# EAGLE design Mainland_revA (EAGLE 9.2.0)

## Sheet 1 of 6
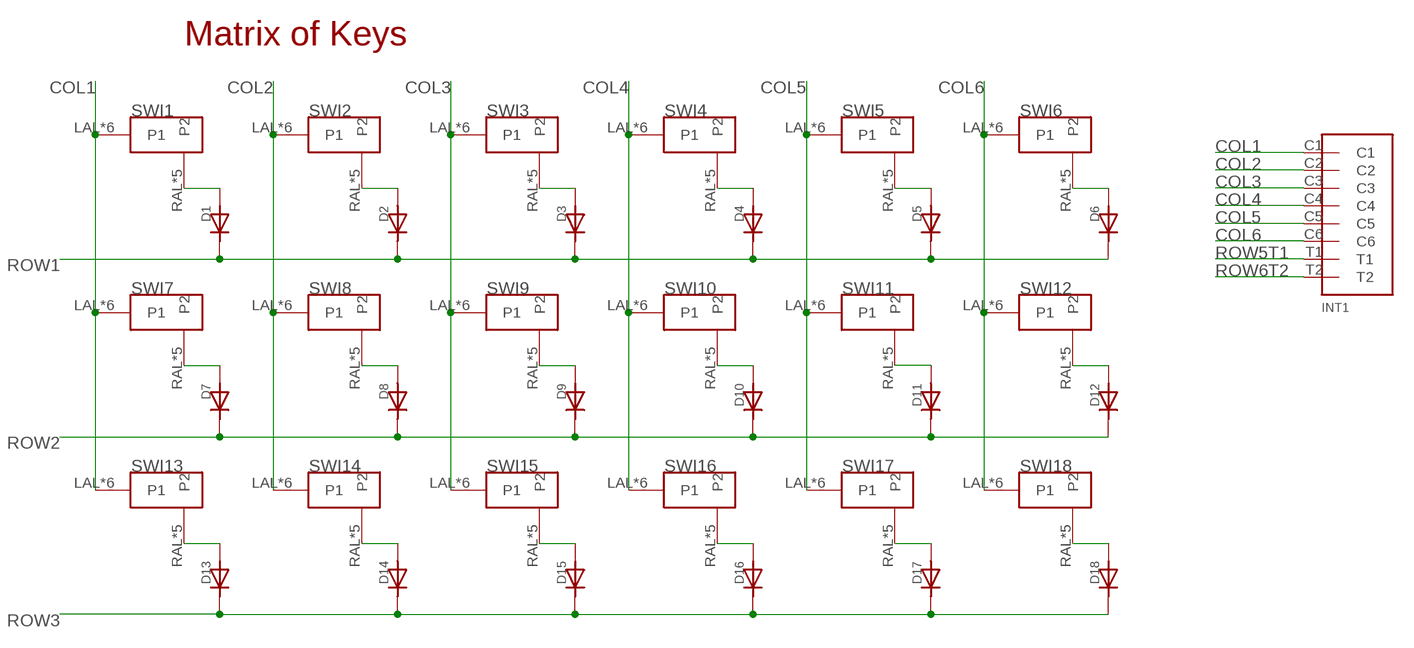
[diagram p0: schematic, sheet 1]

### Parts
D1  DIODE  [DIODE_COMBO]
D2  DIODE  [DIODE_COMBO]
D3  DIODE  [DIODE_COMBO]
D4  DIODE  [DIODE_COMBO]
D5  DIODE  [DIODE_COMBO]
D6  DIODE  [DIODE_COMBO]
D7  DIODE  [DIODE_COMBO]
D8  DIODE  [DIODE_COMBO]
D9  DIODE  [DIODE_COMBO]
D10  DIODE  [DIODE_COMBO]
D11  DIODE  [DIODE_COMBO]
D12  DIODE  [DIODE_COMBO]
D13  DIODE  [DIODE_COMBO]
D14  DIODE  [DIODE_COMBO]
D15  DIODE  [DIODE_COMBO]
D16  DIODE  [DIODE_COMBO]
D17  DIODE  [DIODE_COMBO]
D18  DIODE  [DIODE_COMBO]
INT1  INTRCNNT4X2  [INTRRIBBON]
SWI1  MX/ALPSDOUBLESIDED  [DOUBLED_MX/ALPS]
SWI2  MX/ALPSDOUBLESIDED  [DOUBLED_MX/ALPS]
SWI3  MX/ALPSDOUBLESIDED  [DOUBLED_MX/ALPS]
SWI4  MX/ALPSDOUBLESIDED  [DOUBLED_MX/ALPS]
SWI5  MX/ALPSDOUBLESIDED  [DOUBLED_MX/ALPS]
SWI6  MX/ALPSDOUBLESIDED  [DOUBLED_MX/ALPS]
SWI7  MX/ALPSDOUBLESIDED  [DOUBLED_MX/ALPS]
SWI8  MX/ALPSDOUBLESIDED  [DOUBLED_MX/ALPS]
SWI9  MX/ALPSDOUBLESIDED  [DOUBLED_MX/ALPS]
SWI10  MX/ALPSDOUBLESIDED  [DOUBLED_MX/ALPS]
SWI11  MX/ALPSDOUBLESIDED  [DOUBLED_MX/ALPS]
SWI12  MX/ALPSDOUBLESIDED  [DOUBLED_MX/ALPS]
SWI13  MX/ALPSDOUBLESIDED  [DOUBLED_MX/ALPS]
SWI14  MX/ALPSDOUBLESIDED  [DOUBLED_MX/ALPS]
SWI15  MX/ALPSDOUBLESIDED  [DOUBLED_MX/ALPS]
SWI16  MX/ALPSDOUBLESIDED  [DOUBLED_MX/ALPS]
SWI17  MX/ALPSDOUBLESIDED  [DOUBLED_MX/ALPS]
SWI18  MX/ALPSDOUBLESIDED  [DOUBLED_MX/ALPS]

### Nets
COL1: INT1.C1 SWI1.LAL(P1) SWI1.LAR(P1) SWI1.LCL(P1) SWI1.LCR(P1) SWI1.LLP(P1) SWI1.LRLP(P1) SWI7.LAL(P1) SWI7.LAR(P1) SWI7.LCL(P1) SWI7.LCR(P1) SWI7.LLP(P1) SWI7.LRLP(P1) SWI13.LAL(P1) SWI13.LAR(P1) SWI13.LCL(P1) SWI13.LCR(P1) SWI13.LLP(P1) SWI13.LRLP(P1) ; also sheet 2
COL2: INT1.C2 SWI2.LAL(P1) SWI2.LAR(P1) SWI2.LCL(P1) SWI2.LCR(P1) SWI2.LLP(P1) SWI2.LRLP(P1) SWI8.LAL(P1) SWI8.LAR(P1) SWI8.LCL(P1) SWI8.LCR(P1) SWI8.LLP(P1) SWI8.LRLP(P1) SWI14.LAL(P1) SWI14.LAR(P1) SWI14.LCL(P1) SWI14.LCR(P1) SWI14.LLP(P1) SWI14.LRLP(P1) ; also sheet 2
COL3: INT1.C3 SWI3.LAL(P1) SWI3.LAR(P1) SWI3.LCL(P1) SWI3.LCR(P1) SWI3.LLP(P1) SWI3.LRLP(P1) SWI9.LAL(P1) SWI9.LAR(P1) SWI9.LCL(P1) SWI9.LCR(P1) SWI9.LLP(P1) SWI9.LRLP(P1) SWI15.LAL(P1) SWI15.LAR(P1) SWI15.LCL(P1) SWI15.LCR(P1) SWI15.LLP(P1) SWI15.LRLP(P1) ; also sheet 2
COL4: INT1.C4 SWI4.LAL(P1) SWI4.LAR(P1) SWI4.LCL(P1) SWI4.LCR(P1) SWI4.LLP(P1) SWI4.LRLP(P1) SWI10.LAL(P1) SWI10.LAR(P1) SWI10.LCL(P1) SWI10.LCR(P1) SWI10.LLP(P1) SWI10.LRLP(P1) SWI16.LAL(P1) SWI16.LAR(P1) SWI16.LCL(P1) SWI16.LCR(P1) SWI16.LLP(P1) SWI16.LRLP(P1) ; also sheet 2
COL5: INT1.C5 SWI5.LAL(P1) SWI5.LAR(P1) SWI5.LCL(P1) SWI5.LCR(P1) SWI5.LLP(P1) SWI5.LRLP(P1) SWI11.LAL(P1) SWI11.LAR(P1) SWI11.LCL(P1) SWI11.LCR(P1) SWI11.LLP(P1) SWI11.LRLP(P1) SWI17.LAL(P1) SWI17.LAR(P1) SWI17.LCL(P1) SWI17.LCR(P1) SWI17.LLP(P1) SWI17.LRLP(P1) ; also sheet 2
COL6: INT1.C6 SWI6.LAL(P1) SWI6.LAR(P1) SWI6.LCL(P1) SWI6.LCR(P1) SWI6.LLP(P1) SWI6.LRLP(P1) SWI12.LAL(P1) SWI12.LAR(P1) SWI12.LCL(P1) SWI12.LCR(P1) SWI12.LLP(P1) SWI12.LRLP(P1) SWI18.LAL(P1) SWI18.LAR(P1) SWI18.LCL(P1) SWI18.LCR(P1) SWI18.LLP(P1) SWI18.LRLP(P1) ; also sheet 2
N$1: D1.ANOSB(AN) D1.ANOST(AN) D1.ANOT(AN) SWI1.RAL(P2) SWI1.RAR(P2) SWI1.RCL(P2) SWI1.RCR(P2) SWI1.RLMID(P2)
N$2: D2.ANOSB(AN) D2.ANOST(AN) D2.ANOT(AN) SWI2.RAL(P2) SWI2.RAR(P2) SWI2.RCL(P2) SWI2.RCR(P2) SWI2.RLMID(P2)
N$3: D3.ANOSB(AN) D3.ANOST(AN) D3.ANOT(AN) SWI3.RAL(P2) SWI3.RAR(P2) SWI3.RCL(P2) SWI3.RCR(P2) SWI3.RLMID(P2)
N$4: D4.ANOSB(AN) D4.ANOST(AN) D4.ANOT(AN) SWI4.RAL(P2) SWI4.RAR(P2) SWI4.RCL(P2) SWI4.RCR(P2) SWI4.RLMID(P2)
N$5: D5.ANOSB(AN) D5.ANOST(AN) D5.ANOT(AN) SWI5.RAL(P2) SWI5.RAR(P2) SWI5.RCL(P2) SWI5.RCR(P2) SWI5.RLMID(P2)
N$6: D6.ANOSB(AN) D6.ANOST(AN) D6.ANOT(AN) SWI6.RAL(P2) SWI6.RAR(P2) SWI6.RCL(P2) SWI6.RCR(P2) SWI6.RLMID(P2)
N$7: D7.ANOSB(AN) D7.ANOST(AN) D7.ANOT(AN) SWI7.RAL(P2) SWI7.RAR(P2) SWI7.RCL(P2) SWI7.RCR(P2) SWI7.RLMID(P2)
N$8: D8.ANOSB(AN) D8.ANOST(AN) D8.ANOT(AN) SWI8.RAL(P2) SWI8.RAR(P2) SWI8.RCL(P2) SWI8.RCR(P2) SWI8.RLMID(P2)
N$9: D9.ANOSB(AN) D9.ANOST(AN) D9.ANOT(AN) SWI9.RAL(P2) SWI9.RAR(P2) SWI9.RCL(P2) SWI9.RCR(P2) SWI9.RLMID(P2)
N$10: D10.ANOSB(AN) D10.ANOST(AN) D10.ANOT(AN) SWI10.RAL(P2) SWI10.RAR(P2) SWI10.RCL(P2) SWI10.RCR(P2) SWI10.RLMID(P2)
N$11: D11.ANOSB(AN) D11.ANOST(AN) D11.ANOT(AN) SWI11.RAL(P2) SWI11.RAR(P2) SWI11.RCL(P2) SWI11.RCR(P2) SWI11.RLMID(P2)
N$12: D12.ANOSB(AN) D12.ANOST(AN) D12.ANOT(AN) SWI12.RAL(P2) SWI12.RAR(P2) SWI12.RCL(P2) SWI12.RCR(P2) SWI12.RLMID(P2)
N$13: D13.ANOSB(AN) D13.ANOST(AN) D13.ANOT(AN) SWI13.RAL(P2) SWI13.RAR(P2) SWI13.RCL(P2) SWI13.RCR(P2) SWI13.RLMID(P2)
N$14: D14.ANOSB(AN) D14.ANOST(AN) D14.ANOT(AN) SWI14.RAL(P2) SWI14.RAR(P2) SWI14.RCL(P2) SWI14.RCR(P2) SWI14.RLMID(P2)
N$15: D15.ANOSB(AN) D15.ANOST(AN) D15.ANOT(AN) SWI15.RAL(P2) SWI15.RAR(P2) SWI15.RCL(P2) SWI15.RCR(P2) SWI15.RLMID(P2)
N$16: D16.ANOSB(AN) D16.ANOST(AN) D16.ANOT(AN) SWI16.RAL(P2) SWI16.RAR(P2) SWI16.RCL(P2) SWI16.RCR(P2) SWI16.RLMID(P2)
N$17: D17.ANOSB(AN) D17.ANOST(AN) D17.ANOT(AN) SWI17.RAL(P2) SWI17.RAR(P2) SWI17.RCL(P2) SWI17.RCR(P2) SWI17.RLMID(P2)
N$18: D18.ANOSB(AN) D18.ANOST(AN) D18.ANOT(AN) SWI18.RAL(P2) SWI18.RAR(P2) SWI18.RCL(P2) SWI18.RCR(P2) SWI18.RLMID(P2)
ROW1: D1.CATSB(CAT) D1.CATST(CAT) D1.CATT(CAT) D2.CATSB(CAT) D2.CATST(CAT) D2.CATT(CAT) D3.CATSB(CAT) D3.CATST(CAT) D3.CATT(CAT) D4.CATSB(CAT) D4.CATST(CAT) D4.CATT(CAT) D5.CATSB(CAT) D5.CATST(CAT) D5.CATT(CAT) D6.CATSB(CAT) D6.CATST(CAT) D6.CATT(CAT) ; also sheet 2
ROW2: D7.CATSB(CAT) D7.CATST(CAT) D7.CATT(CAT) D8.CATSB(CAT) D8.CATST(CAT) D8.CATT(CAT) D9.CATSB(CAT) D9.CATST(CAT) D9.CATT(CAT) D10.CATSB(CAT) D10.CATST(CAT) D10.CATT(CAT) D11.CATSB(CAT) D11.CATST(CAT) D11.CATT(CAT) D12.CATSB(CAT) D12.CATST(CAT) D12.CATT(CAT) ; also sheet 2
ROW3: D13.CATSB(CAT) D13.CATST(CAT) D13.CATT(CAT) D14.CATSB(CAT) D14.CATST(CAT) D14.CATT(CAT) D15.CATSB(CAT) D15.CATST(CAT) D15.CATT(CAT) D16.CATSB(CAT) D16.CATST(CAT) D16.CATT(CAT) D17.CATSB(CAT) D17.CATST(CAT) D17.CATT(CAT) D18.CATSB(CAT) D18.CATST(CAT) D18.CATT(CAT) ; also sheet 2
ROW5T1: INT1.T1 ; also sheet 2
ROW6T2: INT1.T2 ; also sheet 2

### Notes on the sheet
- Matrix of Keys

## Sheet 2 of 6
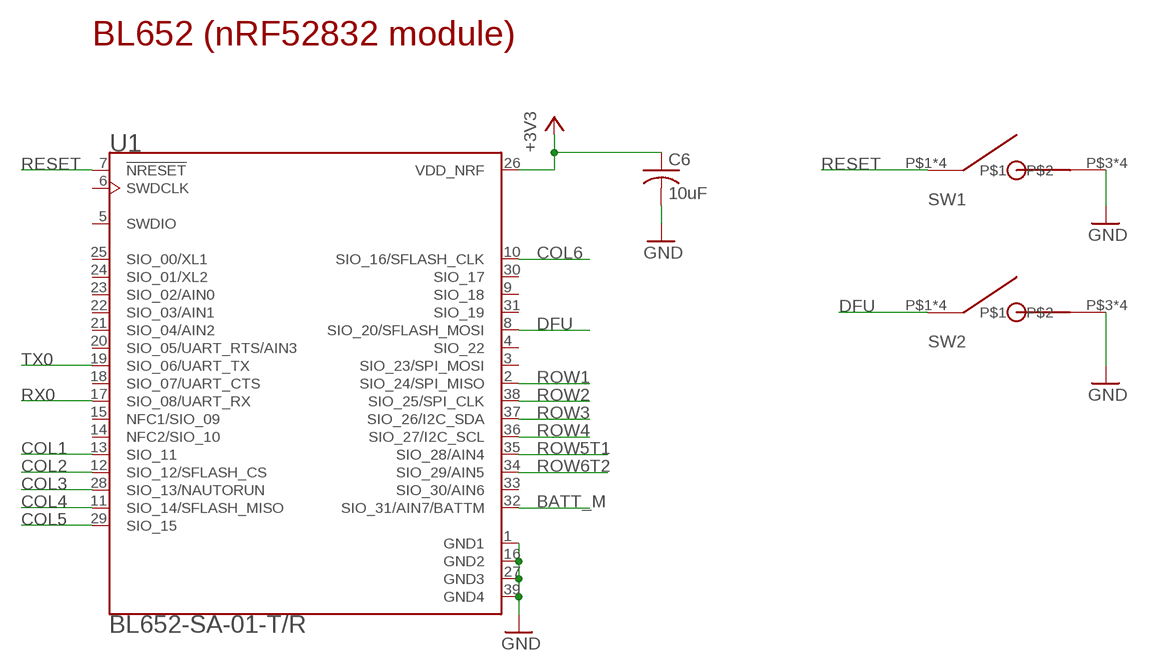
[diagram p1: schematic, sheet 2]

### Parts
C6  10uF  C-USC0805K  [C0805K]
SW1  RSTSWSMD  [FLATSWT]
SW2  RSTSWSMD  [FLATSWT]
U1  BL652-SA-01-T/R  [XCVR_BL652-SA-01-T/R]

### Nets
+3V3: C6.1 U1.26(VDD_NRF) ; also sheet 3,5
BATT_M: U1.32(SIO_31/AIN7/BATTM) ; also sheet 4
COL1: U1.13(SIO_11) ; also sheet 1
COL2: U1.12(SIO_12/SFLASH_CS) ; also sheet 1
COL3: U1.28(SIO_13/NAUTORUN) ; also sheet 1
COL4: U1.11(SIO_14/SFLASH_MISO) ; also sheet 1
COL5: U1.29(SIO_15) ; also sheet 1
COL6: U1.10(SIO_16/SFLASH_CLK) ; also sheet 1
DFU: SW2.P$1 SW2.P$2 SW2.P$5 SW2.P$6 U1.8(SIO_20/SFLASH_MOSI)
GND: C6.2 SW1.P$3 SW1.P$4 SW1.P$7 SW1.P$8 SW2.P$3 SW2.P$4 SW2.P$7 SW2.P$8 U1.1(GND1) U1.16(GND2) U1.27(GND3) U1.39(GND4) ; also sheet 3,4,5,6
RESET: SW1.P$1 SW1.P$2 SW1.P$5 SW1.P$6 U1.7(!NRESET)
ROW1: U1.2(SIO_24/SPI_MISO) ; also sheet 1
ROW2: U1.38(SIO_25/SPI_CLK) ; also sheet 1
ROW3: U1.37(SIO_26/I2C_SDA) ; also sheet 1
ROW4: U1.36(SIO_27/I2C_SCL)
ROW5T1: U1.35(SIO_28/AIN4) ; also sheet 1
ROW6T2: U1.34(SIO_29/AIN5) ; also sheet 1
RX0: U1.17(SIO_08/UART_RX) ; also sheet 5
TX0: U1.19(SIO_06/UART_TX) ; also sheet 5
Unconnected: U1.3(SIO_23/SPI_MOSI) U1.4(SIO_22) U1.5(SWDIO) U1.6(SWDCLK) U1.9(SIO_18) U1.14(NFC2/SIO_10) U1.15(NFC1/SIO_09) U1.18(SIO_07/UART_CTS) U1.20(SIO_05/UART_RTS/AIN3) U1.21(SIO_04/AIN2) U1.22(SIO_03/AIN1) U1.23(SIO_02/AIN0) U1.24(SIO_01/XL2) U1.25(SIO_00/XL1) U1.30(SIO_17) U1.31(SIO_19) U1.33(SIO_30/AIN6)

### Notes on the sheet
- BL652 (nRF52832 module)

## Sheet 3 of 6
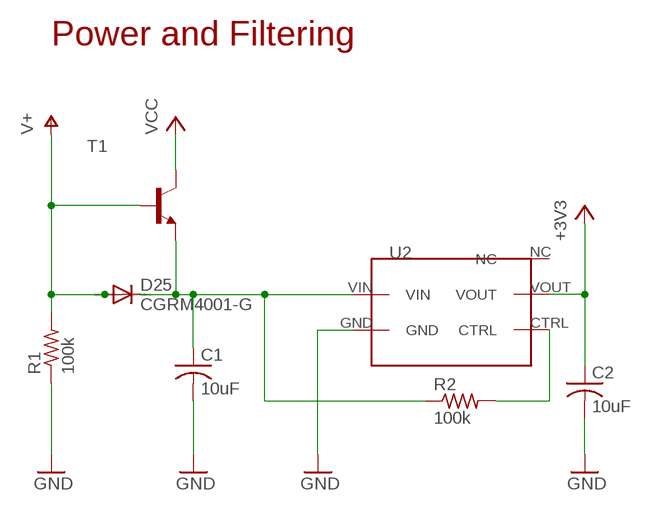
[diagram p2: schematic, sheet 3]

### Parts
C1  10uF  C-USC0805K  [C0805K]
C2  10uF  C-USC0805K  [C0805K]
D25  CGRM4001-G  [SOD-123_MINI-SMA]
R1  100k  R-US_R0402  [R0402]
R2  100k  R-US_R0402  [R0402]
T1  BC808-NPN-SOT23-BEC  [SOT23-BEC]
U2  TCR2EF  [TCR2EF]

### Nets
+3V3: C2.1 U2.VOUT ; also sheet 2,5
GND: C1.2 C2.2 R1.1 U2.GND ; also sheet 2,4,5,6
N$25: R2.2 U2.CTRL
N$26: C1.1 D25.C R2.1 T1.E U2.VIN
V+: D25.A R1.2 T1.B ; also sheet 4,5,6
VCC: T1.C ; also sheet 4,6
Unconnected: U2.NC

### Notes on the sheet
- Power and Filtering

## Sheet 4 of 6
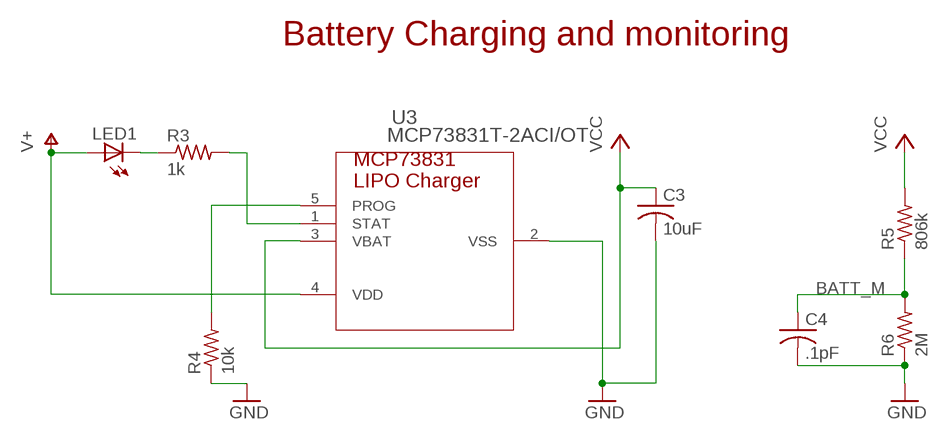
[diagram p3: schematic, sheet 4]

### Parts
C3  10uF  C-USC0805K  [C0805K]
C4  .1pF  C-USC0402K  [C0402K]
LED1  LEDCHIP-LED0603  [CHIP-LED0603]
R3  1k  R-US_R0402  [R0402]
R4  10k  R-US_R0402  [R0402]
R5  806k  R-US_R0402  [R0402]
R6  2M  R-US_R0402  [R0402]
U3  MCP73831T-2ACI/OT  [SOT-23-5_MC]

### Nets
BATT_M: C4.1 R5.1 R6.2 ; also sheet 2
GND: C3.2 C4.2 R4.1 R6.1 U3.2(VSS) ; also sheet 2,3,5,6
N$27: LED1.C R3.1
N$28: R3.2 U3.1(STAT)
N$29: R4.2 U3.5(PROG)
V+: LED1.A U3.4(VDD) ; also sheet 3,5,6
VCC: C3.1 R5.2 U3.3(VBAT) ; also sheet 3,6

### Notes on the sheet
- Battery Charging and monitoring

## Sheet 5 of 6
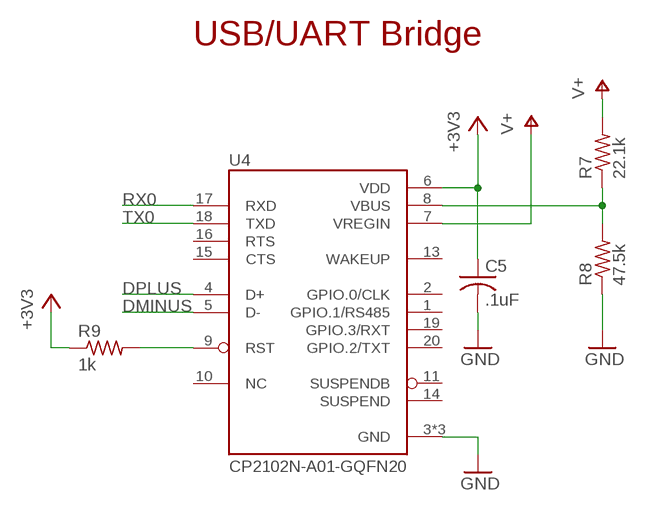
[diagram p4: schematic, sheet 5]

### Parts
C5  .1uF  C-USC0402K  [C0402K]
R7  22.1k  R-US_R0402  [R0402]
R8  47.5k  R-US_R0402  [R0402]
R9  1k  R-US_R0402  [R0402]
U4  CP2102N-A01-GQFN20  [SILABS_QFN20]

### Nets
+3V3: C5.1 R9.1 U4.6(VDD) ; also sheet 2,3
DMINUS: U4.5(D-) ; also sheet 6
DPLUS: U4.4(D+) ; also sheet 6
GND: C5.2 R8.1 U4.3(GND) U4.12(GND) U4.21(GND) ; also sheet 2,3,4,6
N$31: R7.1 R8.2 U4.8(VBUS)
N$32: R9.2 U4.9(RST)
RX0: U4.17(RXD) ; also sheet 2
TX0: U4.18(TXD) ; also sheet 2
V+: R7.2 U4.7(VREGIN) ; also sheet 3,4,6
Unconnected: U4.1(GPIO.1/RS485) U4.2(GPIO.0/CLK) U4.10(NC) U4.11(SUSPENDB) U4.13(WAKEUP) U4.14(SUSPEND) U4.15(CTS) U4.16(RTS) U4.19(GPIO.3/RXT) U4.20(GPIO.2/TXT)

### Notes on the sheet
- USB/UART Bridge

## Sheet 6 of 6
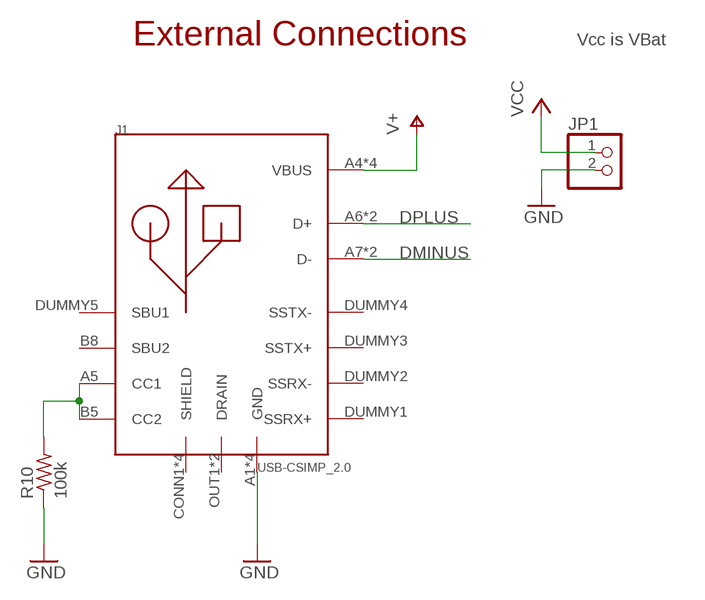
[diagram p5: schematic, sheet 6]

### Parts
J1  USB-CSIMP_2.0  [CX70M-P1_SIMP]
JP1  PINHD-1X2  [1X02]
R10  100k  R-US_R0402  [R0402]

### Nets
DMINUS: J1.A7(D-) J1.B7(D-) ; also sheet 5
DPLUS: J1.A6(D+) J1.B6(D+) ; also sheet 5
GND: J1.A1(GND) J1.A12(GND) J1.B1(GND) J1.B12(GND) JP1.2 R10.1 ; also sheet 2,3,4,5
N$19: J1.A5(CC1) J1.B5(CC2) R10.2
V+: J1.A4(VBUS) J1.A9(VBUS) J1.B4(VBUS) J1.B9(VBUS) ; also sheet 3,4,5
VCC: JP1.1 ; also sheet 3,4
Unconnected: J1.B8(SBU2) J1.CONN1(SHIELD) J1.CONN2(SHIELD) J1.CONN3(SHIELD) J1.CONN4(SHIELD) J1.DUMMY1(SSRX+) J1.DUMMY2(SSRX-) J1.DUMMY3(SSTX+) J1.DUMMY4(SSTX-) J1.DUMMY5(SBU1) J1.OUT1(DRAIN) J1.OUT2(DRAIN)

### Notes on the sheet
- External Connections | Vcc is VBat

## Library data of the parts
C1-C6 = resistor:C-US: CAPACITOR, American symbol
D1-D18 = Keys:DIODE
D25 = diode:CGRM400*-G: Molded plasitc,JEDEC SOD-123/Mini SMA Source: Comchip CGRM4001-G.pdf
INT1 = Keys:INTRCNNT
J1 = Keys:USB-C
JP1 = pinhead:PINHD-1X2: PIN HEADER
LED1 = led:LED: LED OSRAM: - CHIPLED LG R971, LG N971, LY N971, LG Q971, LY Q971, LO R971, LY R971 LH N974, LH R974 LS Q976, LO Q976, LY Q976 LO Q996 - Hyper CHIPLED LW Q18S LB Q993, LB Q99A, LB R99A - SideLED LS A670, LO A670, LY A670, LG A670, LP A670 LB A673, LV A673, LT A673, LW A673 LH A674 LY A675 LS A676, LA A676, LO A676, LY A676, LW A676 LS A679, LY A679, LG A679 - Hyper Micro SIDELED® LS Y876, LA Y876, LO Y876, LY Y876 LT Y87S - SmartLED LW L88C, LW L88S LB L89C, LB L89S, LG L890 LS L89K, LO L89K, LY L89K LS L896, LA L896, LO L896, LY L896 - TOPLED LS T670, LO T670, LY T670, LG T670, LP T670 LSG T670, LSP T670, LSY T670, LOP T670, LYG T670 LG T671, LOG T671, LSG T671 LB T673, LV T673, LT T673, LW T673 LH T674 LS T676, LA T676, LO T676, LY T676, LB T676, LH T676, LSB T676, LW T676 LB T67C, LV T67C, LT T67C, LS T67K, LO T67K, LY T67K, LW E67C LS E67B, LA E67B, LO E67B, LY E67B, LB E67C, LV E67C, LT E67C LW T67C LS T679, LY T679, LG T679 LS T770, LO T770, LY T770, LG T770, LP T770 LB T773, LV T773, LT T773, LW T773 LH T774 LS E675, LA E675, LY E675, LS T675 LS T776, LA T776, LO T776, LY T776, LB T776 LHGB T686 LT T68C, LB T68C - Hyper Mini TOPLED® LB M676 - Mini TOPLED Santana® LG M470 LS M47K, LO M47K, LY M47K Source: http://www.osram.convergy.de LUXEON: - LUMILED® LXK2-PW12-R00, LXK2-PW12-S00, LXK2-PW14-U00, LXK2-PW14-V00 LXK2-PM12-R00, LXK2-PM12-S00, LXK2-PM14-U00 LXK2-PE12-Q00, LXK2-PE12-R00, LXK2-PE12-S00, LXK2-PE14-T00, LXK2-PE14-U00 LXK2-PB12-K00, LXK2-PB12-L00, LXK2-PB12-M00, LXK2-PB14-N00, LXK2-PB14-P00, LXK2-PB14-Q00 LXK2-PR12-L00, LXK2-PR12-M00, LXK2-PR14-Q00, LXK2-PR14-R00 LXK2-PD12-Q00, LXK2-PD12-R00, LXK2-PD12-S00 LXK2-PH12-R00, LXK2-PH12-S00 LXK2-PL12-P00, LXK2-PL12-Q00, LXK2-PL12-R00 Source: www.luxeon.com KINGBRIGHT: KA-3528ASYC Source: www.kingbright.com
R1-R10 = resistor:R-US_: RESISTOR, American symbol
SW1 SW2 = Keys:RSTSW
SWI1-SWI18 = Keys:MX/ALPS
T1 = transistor:*-NPN-: NPN Transistror BF959 corrected 2008.03.06
U1 = BL652-SA-01-T_R:BL652-SA-01-T/R: Bluetooth v4.2 Module with NFC (Integrated Antenna); DESCRIPTION: Bluetooth 1.8V to 3.6V 1Mbps 39-Pin SMD Module T/R; DIGI-KEY_PART_NUMBER: BL652-SA-01-CT-ND; DIGI-KEY_PURCHASE_URL: https://www.digikey.com/product-detail/en/laird-wireless-thermal-systems/BL652-SA-01-T-R/BL652-SA-01-CT-ND/6181738?utm_source=snapeda&utm_medium=aggregator&utm_campaign=symbol; MF: Laird -; MP: BL652-SA-01-T/R; PACKAGE: SMD-39 Laird
U2 = Keys:TCR2EF
U3 = MCP73831:MCP73831T-2ACI/OT; MANUFACTURER_PART_NUMBER: MCP73831T2ACIOT; VENDOR: Microchip
U4 = CP2102N-A01-GQFN20:CP2102N-A01-GQFN20: Ic Bridge Usb To Uart 20qfn; DESCRIPTION: Usb-Uart Interface Bridge, Qfn-20; DIGI-KEY_PART_NUMBER: 336-3692-ND; DIGI-KEY_PURCHASE_URL: https://www.digikey.com/product-detail/en/silicon-labs/CP2102N-A01-GQFN20/336-3692-ND/6012517?utm_source=snapeda&utm_medium=aggregator&utm_campaign=symbol; MF: Silicon Labs; MP: CP2102N-A01-GQFN20; PACKAGE: QFN-20 Silicon Labs

## Net classes
1 Power: width 0.254 mm

## Board
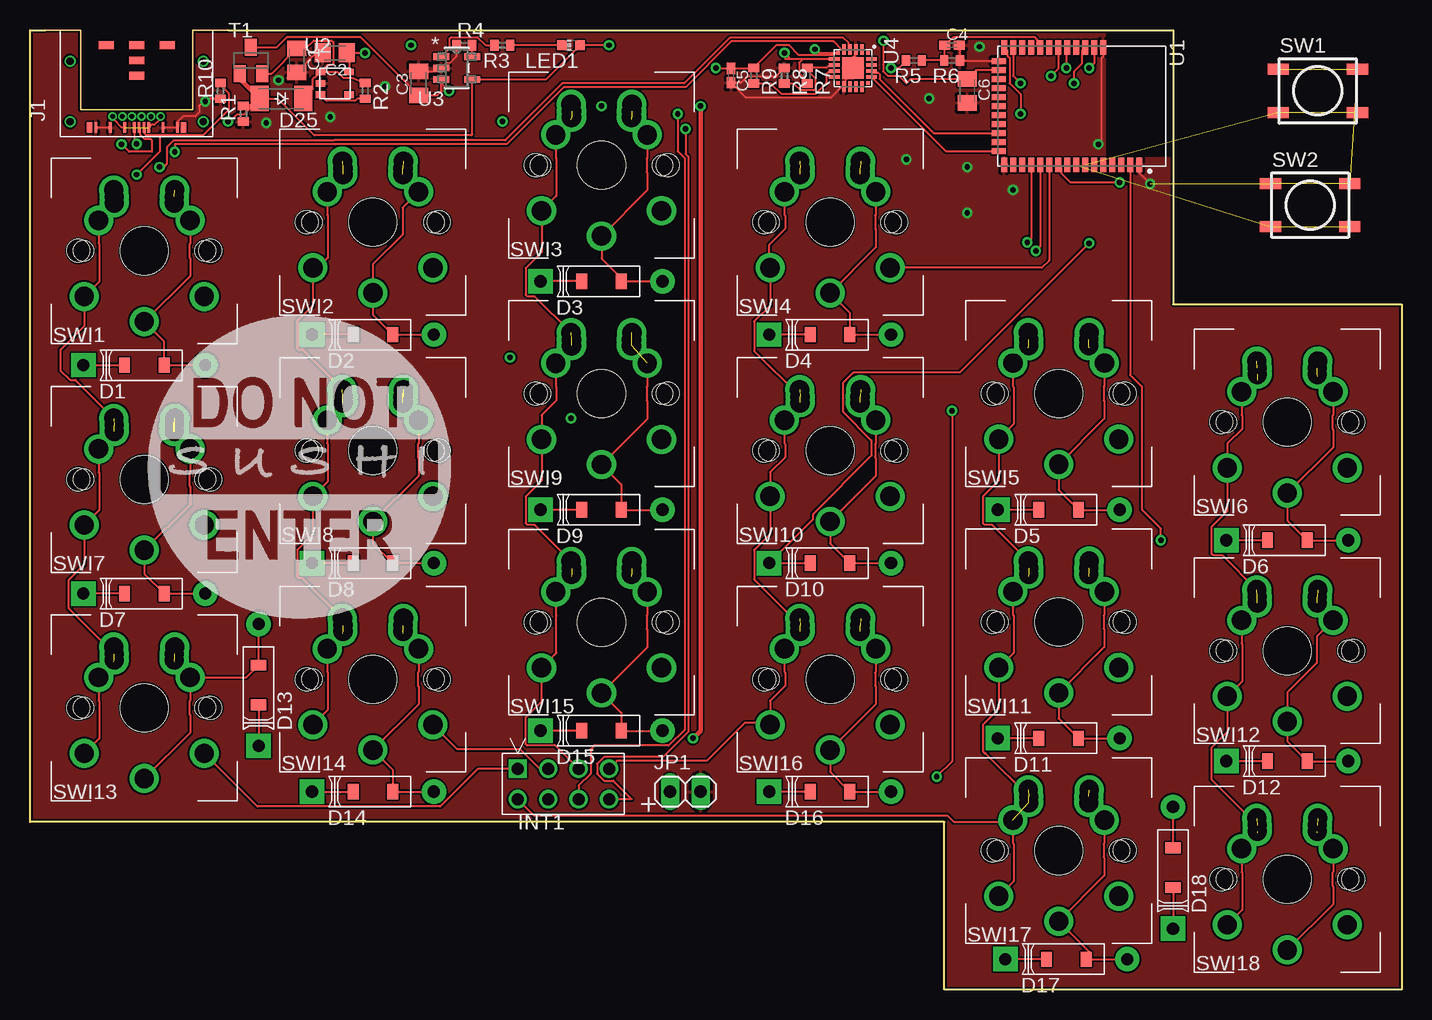
[diagram p6: board, top side]
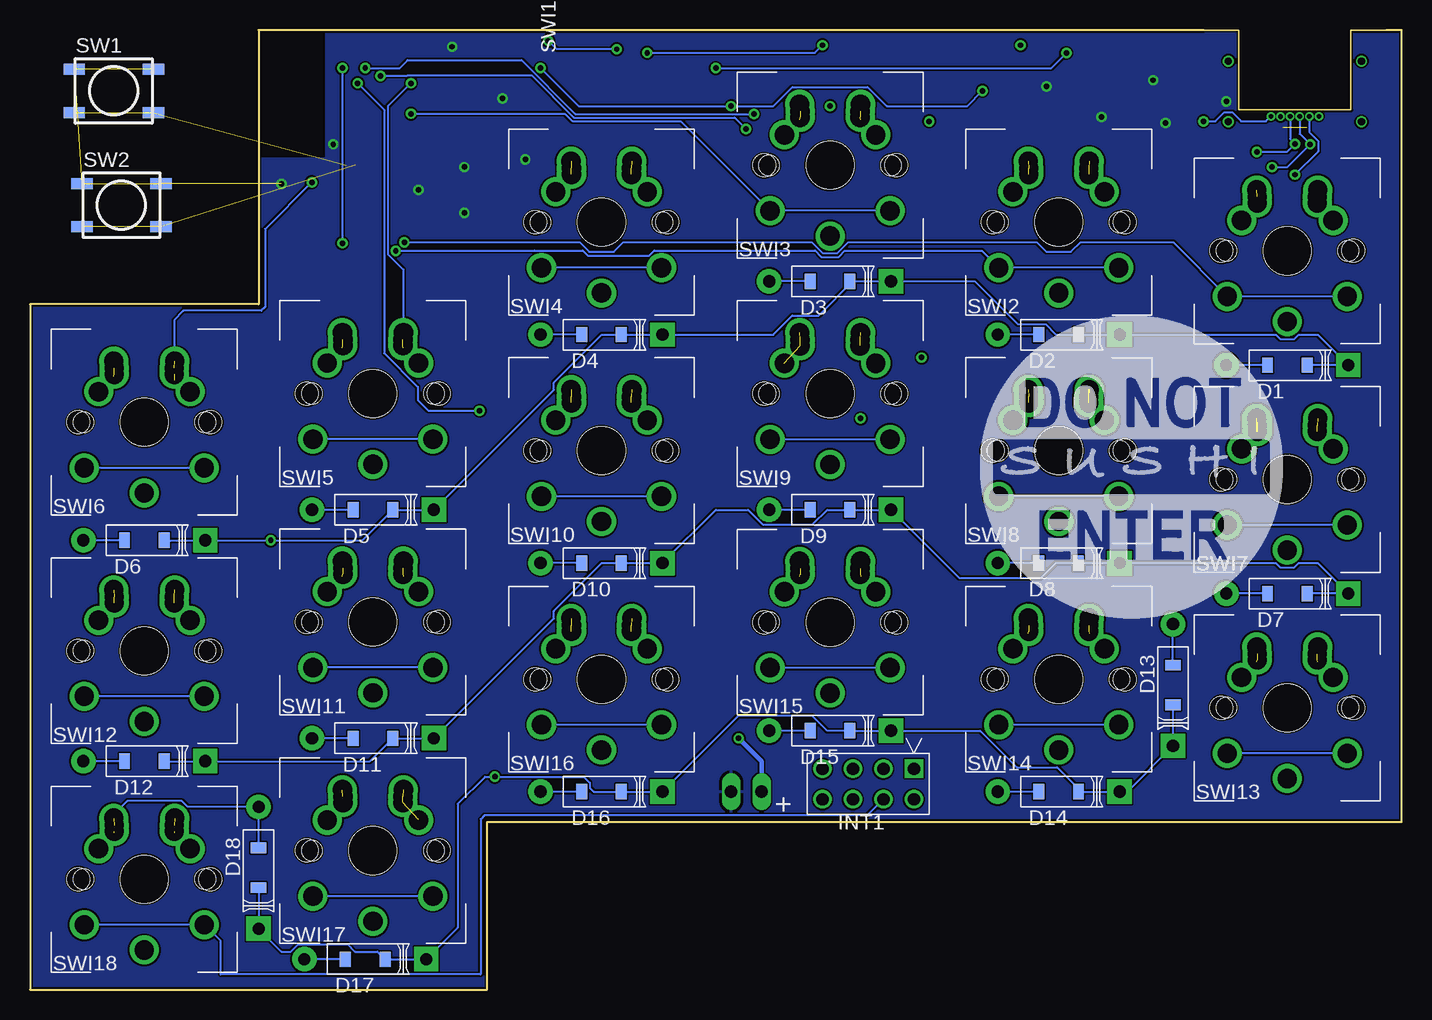
[diagram p7: board, bottom side, seen from below]

Size 114.3 x 80.01 mm. Coordinates in mm from the lower left corner, seen from the top.
Outline: 1.27,80.01 0,80.01 0,13.97 76.2,13.97 76.2,0 114.3,0 114.3,57.15 95.25,57.15 95.25,80.01 16.51,80.01
Copper layers (1*16): Top 0.035mm / dielectric 1.5mm / Bottom 0.035mm
Design rules "Sierra *": minimum track width 6mil, minimum drill 10mil, track to track 6mil, track to pad 6mil, pad to pad 6mil, via to via 6mil, smd to smd 6mil, copper to edge 6mil, drill to drill 10mil, minimum pad ring 6mil, minimum via ring 8mil, stop-mask expansion 4mil, vias tented up to drill 0mil, thermal gap 10mil
tKeepout: area 90.2,69.8 to 95.9,80.6
bKeepout: area 90.2,69.8 to 95.9,80.6
tRestrict: area 89.8,69.5 to 95.9,80.6
bRestrict: area 89.8,69.5 to 95.9,80.6

### Footprints (pad centres in the part's own frame; a part is rotated, then mirrored left to right if it is on the bottom)
C0805K = smd 1.3 x 1.6: 1 -1,0; 2 1,0
C0402K = smd 0.925 x 0.74: 1 -0.6,0; 2 0.6,0
DIODE_COMBO = smd 0.914 x 1.27 bottom: ANOSB 1.651,0; CATSB -1.651,0 | smd 0.914 x 1.27: ANOST 1.651,0; CATST -1.651,0 | drill 1.016 pad 2.032: ANOT 5.08,0 | drill 1.016 pad 2.032 square: CATT -5.08,0
SOD-123_MINI-SMA = smd 1.5 x 2.1: A 1.8,0; C -1.8,0
INTRRIBBON = drill 1.016 square: C1 0,0 | drill 1.016: C2 2.54,0; C3 5.08,0; C4 7.62,0; C5 0,-2.54; C6 2.54,-2.54; T1 5.08,-2.54; T2 7.62,-2.54
CX70M-P1_SIMP = smd 0.23 x 0.85: A1 2.2,-8.125; A4 1,-8.125; A5 0.6,-8.125; A6 0.2,-8.125; A7 -0.2,-8.125; A9 -1,-8.125; A12 -2.2,-8.125; B1 -3.4,-8.125; B12 3.4,-8.125 | drill 0.4 pad 0.6: B4 -2,-7.2; B5 -1.2,-7.2; B6 -0.4,-7.2; B7 0.4,-7.2; B8 1.2,-7.22; B9 2,-7.2 | drill 0.6: CONN1 -5.55,-2.6; CONN2 5.55,-2.6; CONN3 -5.55,-7.65; CONN4 5.55,-7.65 | smd 1.27 x 0.635: DUMMY1 -2.54,-1.27; DUMMY2 0,-1.27; DUMMY3 2.54,-1.27; DUMMY4 0,-2.54; DUMMY5 0,-3.81 | smd 0.46 x 0.85: OUT1 -3.915,-8.125; OUT2 3.915,-8.125
1X02 = drill 1.016 long: 1 -1.27,0; 2 1.27,0
CHIP-LED0603 = smd 0.8 x 0.8: A 0,-0.75; C 0,0.75
R0402 = smd 0.7 x 0.9: 1 -0.65,0; 2 0.65,0
FLATSWT = smd 1.778 x 0.914: P$1 -3.3,-1.8; P$2 3.3,-1.8; P$3 -3.3,1.8; P$4 3.3,1.8 | smd 1.778 x 0.914 bottom: P$5 -3.3,-1.8; P$6 3.3,-1.8; P$7 -3.3,1.8; P$8 3.3,1.8
DOUBLED_MX/ALPS = drill 1.613: LAL -2.5,4; LAR -2.5,4.5; LCL -3.81,2.54; LCR -2.54,5.08; LLP -5,-3.8; LRLP 5,-3.8; RAL 2.5,4; RAR 2.5,4.5; RCL 3.81,2.54; RCR 2.54,5.08; RLMID 0,-5.9 | hole 3.988: 0,0 | hole 1.702: -5.08,0; 5.08,0 | hole 1.9: -5.5,0; 5.5,0
SOT23-BEC = smd 1 x 1.4: B -0.95,-1.1; C 0,1.1; E 0.95,-1.1
XCVR_BL652-SA-01-T/R = smd 1.2 x 0.5: 1 4.9,4.8; 2 4.9,4.05; 3 4.9,3.3; 4 4.9,2.55; 5 4.9,1.8; 6 4.9,1.05; 7 4.9,0.3; 8 4.9,-0.45; 9 4.9,-1.2; 10 4.9,-1.95; 11 4.9,-2.7; 12 4.9,-3.45; 13 4.9,-4.2; 14 4.9,-4.95; 15 4.9,-5.7; 16 4.9,-6.45; 28 -4.9,-6.45; 29 -4.9,-5.7; 30 -4.9,-4.95; 31 -4.9,-4.2; 32 -4.9,-3.45; 33 -4.9,-2.7; 34 -4.9,-1.95; 35 -4.9,-1.2; 36 -4.9,-0.45; 37 -4.9,0.3; 38 -4.9,1.05; 39 -4.9,1.8 | smd 0.5 x 1.2: 17 3.75,-6.9; 18 3,-6.9; 19 2.25,-6.9; 20 1.5,-6.9; 21 0.75,-6.9; 22 0,-6.9; 23 -0.75,-6.9; 24 -1.5,-6.9; 25 -2.25,-6.9; 26 -3,-6.9; 27 -3.75,-6.9
TCR2EF = smd 0.8 x 0.55: CTRL -1.2,-0.95; GND -1.2,0; NC 1.2,-0.95; VIN -1.2,0.95; VOUT 1.2,0.95
SOT-23-5_MC = smd 1.321 x 0.559: 1 -1.295,0.95; 2 -1.295,0; 3 -1.295,-0.95; 4 1.295,-0.95; 5 1.295,0.95
SILABS_QFN20 = smd 0.3 x 0.3: 1 -1.25,1.25; 6 -1.25,-1.25; 11 1.25,-1.25; 16 1.25,1.25 | smd 0.9 x 0.3: 2 -1.55,0.75; 3 -1.55,0.25; 4 -1.55,-0.25; 5 -1.55,-0.75; 12 1.55,-0.75; 13 1.55,-0.25; 14 1.55,0.25; 15 1.55,0.75 | smd 0.3 x 0.9: 7 -0.75,-1.55; 8 -0.25,-1.55; 9 0.25,-1.55; 10 0.75,-1.55; 17 0.75,1.55; 18 0.25,1.55; 19 -0.25,1.55; 20 -0.75,1.55 | smd 1.8 x 1.8: 21 0,0

### Placement (x,y rotation side)
C1  22.23,77.47 270 top
C2  25.4,78.1 180 top
C3  32.38,75.56 90 top
C4  76.84,78.74 0 top
C5  58.42,76.2 270 top
C6  78.1,74.93 270 top
D1  9.52,52.07 0 top
D2  28.57,54.61 0 top
D3  47.63,59.05 0 top
D4  66.68,54.61 0 top
D5  85.72,40.01 0 top
D6  104.78,37.46 0 top
D7  9.52,33.02 0 top
D8  28.57,35.56 0 top
D9  47.63,40.01 0 top
D10  66.68,35.56 0 top
D11  85.72,20.95 0 top
D12  104.78,19.05 0 top
D13  19.05,25.4 90 top
D14  28.57,16.51 0 top
D15  47.63,21.59 0 top
D16  66.68,16.51 0 top
D17  86.36,2.54 0 top
D18  95.25,10.16 90 top
D25  20.95,74.29 180 top
INT1  40.64,18.41 0 top
J1  8.89,80.01 0 top
JP1  54.61,16.51 0 top
LED1  45.09,78.74 90 top
R1  17.78,73.03 90 top
R2  27.94,74.93 270 top
R3  39.37,78.74 180 top
R4  36.2,78.74 0 top
R5  73.66,77.47 180 top
R6  76.84,77.47 180 top
R7  64.77,76.2 270 top
R8  62.87,76.2 270 top
R9  60.32,76.2 270 top
R10  15.88,74.93 90 top
SW1  107.31,74.93 0 top
SW2  106.68,65.41 0 top
SWI1  9.52,61.59 0 top
SWI2  28.57,63.98 0 top
SWI3  47.63,68.73 0 top
SWI4  66.68,63.98 0 top
SWI5  85.72,49.7 0 top
SWI6  104.78,47.31 0 top
SWI7  9.52,42.54 0 top
SWI8  28.57,44.93 0 top
SWI9  47.63,49.68 0 top
SWI10  66.68,44.93 0 top
SWI11  85.72,30.65 0 top
SWI12  104.78,28.26 0 top
SWI13  9.52,23.49 0 top
SWI14  28.57,25.88 0 top
SWI15  47.63,30.63 0 top
SWI16  66.68,25.88 0 top
SWI17  85.72,11.6 0 top
SWI18  104.78,9.21 0 top
T1  18.41,77.47 0 top
U1  87.63,73.66 270 top
U2  25.4,75.56 0 top
U3  35.56,76.84 0 top
U4  68.58,76.84 270 top
U$1  [1INCH_TOP]  9.78,30.86 0 top
U$2  [1INCH_BOT]  9.78,30.86 0 top

### Tracks (layer width: path | path; a pad name or v marks a point on that pad's centre or on a via)
+3V3  (via drill 0.45)
  Top 0.152: U1.26 78.84,76.66 C6.1 73.39,75.93 73.03,75.56 72.41,76.18 71.48,76.18 71.1,76.56 71.1,77.11 71.12,77.13 v71.12,79.11 | 26.54,77.97 26.6,77.91 U2.VOUT | 26.54,77.97 C2.1 | v57.15,76.84 57.18,76.8 C5.1 60.27,76.8 R9.1 62.24,78.76 63.21,78.76 64.01,77.96 66.92,77.96 67.04,78.09 U4.6 65.73,78.09 v65.41,78.41 | v27.93,78.09 26.66,78.09 26.54,77.97
  Bottom 0.152: v57.15,76.84 29.19,76.84 v27.93,78.09 | v65.41,78.41 70.42,78.41 v71.12,79.11
BATT_M
  Top 0.152: R5.1 R6.2 76.19,78.69 C4.1 76.28,78.74 76.93,79.39 83.78,79.39 83.91,79.25 83.91,78.83 U1.32
COL1  (via drill 0.45)  (4 unrouted)
  Top 0.152: SWI1.LAR 7.02,66.63 SWI1.LCR 6.98,64.77 | SWI1.LAR SWI1.LAL | SWI1.LAR 7.02,65.44 SWI1.LCL 5.72,62.2 5.77,62.15 5.77,59.04 SWI1.LLP 4.52,55.32 2.54,53.34 2.54,51.62 3.33,50.82 3.79,50.82 SWI7.LCR | SWI7.LAL 7.02,46.4 SWI7.LCL 5.72,43.15 5.77,43.09 5.77,39.99 SWI7.LLP 4.52,35.45 3.2,34.13 3.2,31.82 SWI13.LAR | SWI13.LCR 6.98,27.3 SWI13.LCL 5.72,24.1 5.77,24.04 5.77,20.94 SWI13.LLP | INT1.C1 37.32,18.41 34.17,15.27 18.95,15.27 SWI13.LRLP | U1.13 83.43,62.63 v83.11,62.31
  Bottom 0.152: SWI1.LLP SWI1.LRLP 19.04,62.31 26.76,62.31 27.55,61.51 29.6,61.51 30.39,62.31 46.12,62.31 47.03,61.39 48.22,61.39 49.13,62.31 64.86,62.31 65.65,61.51 67.7,61.51 68.49,62.31 v83.11,62.31 | SWI7.LLP SWI7.LRLP | SWI13.LLP SWI13.LRLP
COL2  (via drill 0.45)  (6 unrouted)
  Top 0.152: SWI2.LAR 25.54,67.94 25.4,67.94 25.4,67.16 SWI2.LCL 24.77,64.59 24.82,64.53 24.82,61.02 23.57,59.77 | 23.49,59.69 23.57,59.77 | 23.57,59.77 SWI2.LLP 23.57,57.04 22.25,55.72 22.25,53.5 22.38,53.37 22.68,53.37 SWI8.LCR | SWI8.LAR 24.77,48.12 SWI8.LCL 24.77,45.54 24.82,45.48 24.82,42.38 SWI8.LLP 23.57,37.99 22.25,36.67 22.25,34.45 22.38,34.31 22.68,34.31 SWI14.LCR 26.04,29.69 SWI14.LCL 24.77,26.49 24.82,26.43 24.82,23.33 SWI14.LLP | INT1.C2 42.49,18.41 40.86,20.04 35.62,20.04 SWI14.LRLP | U1.12 84.18,61.95 v83.82,61.59
  Bottom 0.152: SWI2.LLP SWI2.LRLP 34.99,61.59 46.4,61.59 46.9,61.09 48.35,61.09 48.88,61.62 62.27,61.62 62.68,61.21 67.82,61.21 68.24,61.62 72.27,61.62 72.3,61.59 v83.82,61.59 | SWI8.LLP SWI8.LRLP | SWI14.LLP SWI14.LRLP
COL3  (via drill 0.45)  (6 unrouted)
  Top 0.152: SWI3.LCR 45.09,72.54 SWI3.LCL 43.82,69.34 43.87,69.28 43.87,66.18 SWI3.LLP 42.63,61.49 41.3,60.17 41.3,57.94 41.43,57.81 42.04,57.81 SWI9.LCR | SWI9.LAL 43.82,52.37 SWI9.LCL 43.82,50.29 43.87,50.23 43.87,49.13 42.63,47.89 SWI9.LLP 42.63,42.44 41.3,41.12 41.3,38.89 41.43,38.76 42.04,38.76 SWI15.LCR 45.09,34.44 SWI15.LCL 43.82,31.24 43.87,31.18 43.87,28.08 SWI15.LLP 42.63,24.02 41.3,22.7 41.3,20.48 41.43,20.34 43.79,20.34 INT1.C3 | U1.28 81.45,78.29 81.45,77.87 81.62,77.69 81.62,75.56 82.55,74.64 v82.55,73.03
  Bottom 0.152: SWI3.LLP SWI3.LRLP 60.09,72.39 69.1,72.39 69.74,73.03 v82.55,73.03 | SWI9.LLP SWI9.LRLP | SWI15.LLP SWI15.LRLP
COL4  (6 unrouted)
  Top 0.152: SWI4.LAL 62.87,66.67 SWI4.LCL 62.87,64.59 62.92,64.53 62.92,63.43 61.6,62.11 61.6,60.18 | SWI10.LAR 60.35,53.26 60.35,55.72 61.68,57.04 SWI4.LLP 61.6,60.18 | SWI10.LAL 62.87,47.62 SWI10.LCL 62.87,45.54 62.92,45.48 62.92,44.38 61.68,43.14 SWI10.LLP 61.68,37.99 60.35,36.67 60.35,34.21 SWI16.LAR | SWI16.LAL 62.87,28.57 SWI16.LCL 62.87,26.49 62.92,26.43 62.92,25.33 61.68,24.09 61.68,22.22 | 61.68,22.22 SWI16.LLP | INT1.C4 48.92,19.07 56.4,19.07 59.54,22.22 61.68,22.22 | U1.11 84.93,60.8 84.31,60.18 SWI4.LRLP | 61.6,60.18 61.6,59.69
  Bottom 0.152: SWI4.LLP SWI4.LRLP | SWI10.LLP SWI10.LRLP | SWI16.LLP SWI16.LRLP
COL5  (via drill 0.45)  (7 unrouted)
  Top 0.152: SWI5.LCR 83.19,53.51 SWI5.LCL 81.91,50.3 81.97,50.24 81.97,47.14 SWI5.LLP | 80.72,45.8 SWI5.LLP | SWI5.LLP 80.72,42.44 79.4,41.12 79.4,38.89 79.53,38.76 80.15,38.76 SWI11.LCR 83.19,34.45 SWI11.LCL 81.91,31.25 81.97,31.2 81.97,28.09 SWI11.LLP 80.72,23.39 79.4,22.07 79.4,19.84 79.53,19.71 79.61,19.71 SWI17.LAR | SWI17.LCL 81.91,13.97 | 81.91,13.97 81.91,12.2 81.97,12.14 81.97,9.04 SWI17.LLP | 81.91,13.97 76.98,13.97 76.43,14.52 41.99,14.52 INT1.C5 | U1.29 81.93,76.19 v82.55,75.56
  Bottom 0.152: SWI5.LLP SWI5.LRLP | SWI11.LLP SWI11.LRLP | SWI17.LLP SWI17.LRLP | SWI5.LCR 83.19,60.03 84.48,61.32 84.48,73.64 v82.55,75.56
COL6  (via drill 0.45)  (6 unrouted)
  Top 0.152: SWI6.LAR 102.28,50.84 101.28,49.85 SWI6.LCL 100.97,47.91 101.02,47.86 101.02,46.76 99.78,45.51 SWI6.LLP 99.78,39.9 98.45,38.58 98.45,36.35 98.58,36.22 99.35,36.22 SWI12.LCR | SWI12.LAL 102.28,32.11 SWI12.LCL 100.97,28.86 101.02,28.81 101.02,25.7 SWI12.LLP 99.78,21.48 98.45,20.16 98.45,17.53 SWI18.LAR 102.28,13.06 SWI18.LCL 100.97,9.81 101.02,9.76 101.02,6.65 SWI18.LLP | U1.10 85.95,68.49 85.95,68.06 86.71,67.31 v90.81,67.31
  Bottom 0.152: SWI6.LLP SWI6.LRLP | SWI12.LLP SWI12.LRLP | SWI18.LRLP SWI18.LLP 98.42,4.06 98.42,1.27 76.75,1.27 76.75,14.2 76.43,14.52 44.53,14.52 INT1.C6 | SWI6.LAR 102.28,55.84 101.52,56.6 95.02,56.6 94.7,56.92 94.7,63.42 v90.81,67.31
DFU  (4 unrouted)
DMINUS  (via drill 0.45)
  Top 0.152: v8.89,70.51 8.69,70.71 J1.A7 | U4.5 67.65,78.38 66.97,79.07 58.45,79.07 54.64,75.25 44.49,75.25 39.74,70.5 25.44,70.5 25.42,70.48 12.07,70.48 v12.07,69.85
  Bottom 0.152: J1.B7 9.29,70.91 v8.89,70.51 9.55,69.85 v12.07,69.85
DPLUS  (via drill 0.45)
  Top 0.152: v7.62,70.48 8.26,69.85 10.16,69.85 10.16,70.81 10.05,70.93 9.55,70.93 9.15,71.33 9.15,71.83 J1.A6 | U4.4 68.21,78.51 68.21,78.93 67.77,79.37 58.33,79.37 54.51,75.56 44.36,75.56 39.61,70.81 25.31,70.81 25.3,70.79 11.94,70.79 11.41,70.26 11.41,68.86 11.12,68.58 v10.8,68.58
  Bottom 0.152: J1.B6 8.49,71.35 v7.62,70.48 9.52,68.58 v10.8,68.58
GND  (via drill 0.45)  (8 unrouted)
  Top 0.152: R8.1 62.14,76.13 59.78,76.13 59.25,75.6 C5.2 59.66,74.36 66.73,74.36 67.65,75.28 U4.12 67.95,75.41 67.95,75.83 68.09,75.96 68.51,75.96 68.58,76.03 U4.21 68.58,77.71 68.71,77.84 68.71,78.26 U4.3 | J1.A1 J1.B12 12.35,71.94 12.35,72.41 12.76,72.82 13.78,72.82 14.1,73.14 14.1,73.69 14.69,74.28 R10.1 | J1.A12 J1.B1 | C4.2 77.49,78.69 R6.1 77.54,77.41 U1.27 | C2.2 23.86,78.1 C1.2 21.88,76.47 21.4,76 | C3.2 33.99,76.56 U3.2 34.71,77.28 35.02,77.28 35.54,77.8 R4.1 | U1.39 89.43,77.8 89.28,77.65 89.28,70.74 v89.03,70.48 | U1.1 92.43,68.1 v93.34,67.18
  other vias: 74.93,74.29 73.03,69.22 78.1,68.58 78.1,64.77 81.91,66.68 79.12,78.61 14.61,74.04 20.7,75.82 19.69,72.26 29.59,75.31 25.02,72.77
  pour Top (isolate 1.27): 37.46,76.2 33.66,76.2 33.66,75.56 29.21,75.56 29.21,79.38 39.37,79.38 39.37,76.2
  pour Bottom: 0,80.01 4.45,80.01 4.45,73.66 13.34,73.66 13.34,80.01 95.25,80.01 95.25,57.15 114.3,57.15 114.3,0 76.2,0 76.2,13.97 0,13.97
  pour Top: 0,80.01 4.45,80.01 4.45,73.66 13.34,73.66 13.34,80.01 95.25,80.01 95.25,57.15 114.3,57.15 114.3,0 76.2,0 76.2,13.97 0,13.97
N$1  (1 unrouted)
  Top 0.152: D1.ANOT D1.ANOST 11.18,54.04 SWI1.RLMID 13.34,59.51 13.34,60.99 13.28,61.04 13.28,62.15 13.34,62.2 SWI1.RCL 13.34,64.78 SWI1.RAR | SWI1.RAR SWI1.RAL | SWI1.RAR 12.02,64.81 12.07,64.77
  Bottom 0.152: D1.ANOST D1.ANOT
N$2  (2 unrouted)
  Top 0.152: SWI2.RAL 31.07,67.35 32.38,66.04 SWI2.RCL 31.04,65.18 31.04,62.96 28.57,60.49 SWI2.RLMID 28.57,56.26 D2.ANOST D2.ANOT
  Bottom 0.152: D2.ANOST D2.ANOT
N$3  (2 unrouted)
  Top 0.152: D3.ANOST 49.53,59.05 | 49.53,59.05 D3.ANOT | SWI3.RCR 50.16,72.54 SWI3.RCL 51.43,69.34 51.38,69.28 51.38,68.18 51.43,68.13 51.43,66.64 SWI3.RLMID 47.63,60.96 49.53,59.05
  Bottom 0.152: D3.ANOST D3.ANOT
N$4  (2 unrouted)
  Top 0.152: D4.ANOT D4.ANOST 68.33,56.43 SWI4.RLMID 70.49,61.89 70.49,63.38 70.43,63.43 70.43,64.53 70.49,64.59 SWI4.RCL 70.49,66.67 SWI4.RAL
  Bottom 0.152: D4.ANOST D4.ANOT
N$5  (2 unrouted)
  Top 0.152: D5.ANOT D5.ANOST 85.72,41.66 SWI5.RLMID 89.53,47.6 89.53,49.09 89.48,49.15 89.48,50.24 89.53,50.3 SWI5.RCL 88.26,53.51 SWI5.RCR
  Bottom 0.152: D5.ANOST D5.ANOT
N$6  (2 unrouted)
  Top 0.152: D6.ANOT D6.ANOST 104.78,39.12 SWI6.RLMID 108.59,45.22 108.59,46.7 108.53,46.76 108.53,47.86 108.59,47.91 SWI6.RCL 107.31,51.12 SWI6.RCR
  Bottom 0.152: D6.ANOST D6.ANOT
N$7  (2 unrouted)
  Top 0.152: SWI7.RAL 13.34,45.23 SWI7.RCL 13.34,43.15 13.28,43.09 13.28,41.99 13.34,41.94 13.34,40.45 SWI7.RLMID 9.52,34.67 D7.ANOST D7.ANOT
  Bottom 0.152: D7.ANOST D7.ANOT
N$8  (2 unrouted)
  Top 0.152: SWI8.RAL 32.38,47.62 SWI8.RCL 32.38,45.54 32.33,45.48 32.33,44.38 32.38,44.33 32.38,42.84 SWI8.RLMID 28.57,37.21 D8.ANOST D8.ANOT
  Bottom 0.152: D8.ANOST D8.ANOT
N$9  (3 unrouted)
  Top 0.152: D9.ANOT D9.ANOST 49.28,42.13 SWI9.RLMID 51.43,47.59 51.43,49.08 51.38,49.13 51.38,50.23 51.43,50.29 SWI9.RCL
  Bottom 0.152: D9.ANOST D9.ANOT 53.34,40.01
N$10  (2 unrouted)
  Top 0.152: D10.ANOT D10.ANOST 66.68,37.21 SWI10.RLMID 70.49,42.84 70.49,44.33 70.43,44.38 70.43,45.48 70.49,45.54 SWI10.RCL 70.49,47.62 SWI10.RAL
  Bottom 0.152: D10.ANOST D10.ANOT
N$11  (2 unrouted)
  Top 0.152: D11.ANOT D11.ANOST 85.72,22.61 SWI11.RLMID 89.53,28.55 89.53,30.04 89.48,30.09 89.48,31.2 89.53,31.25 SWI11.RCL 88.26,34.45 SWI11.RCR
  Bottom 0.152: D11.ANOST D11.ANOT
N$12  (2 unrouted)
  Top 0.152: D12.ANOT D12.ANOST 104.78,20.7 SWI12.RLMID 104.78,24.76 107.25,27.23 107.25,29.46 SWI12.RCL 108.59,30.95 SWI12.RAL
  Bottom 0.152: D12.ANOST D12.ANOT
N$13  (2 unrouted)
  Top 0.152: D13.ANOT D13.ANOST 18.03,26.04 SWI13.RCL | SWI13.RCR 12.07,27.3 SWI13.RCL | SWI13.RLMID 13.34,21.4 13.34,22.89 13.28,22.95 13.28,24.04 13.34,24.1 SWI13.RCL
  Bottom 0.152: D13.ANOST D13.ANOT
N$14  (2 unrouted)
  Top 0.152: D14.ANOT D14.ANOST 30.23,18.33 SWI14.RLMID 32.38,23.79 32.38,25.28 32.33,25.33 32.33,26.43 32.38,26.49 SWI14.RCL 31.12,29.69 SWI14.RCR
  Bottom 0.152: D14.ANOST D14.ANOT
N$15  (2 unrouted)
  Top 0.152: D15.ANOT D15.ANOST 49.28,23.08 SWI15.RLMID 51.43,28.54 51.43,30.03 51.38,30.08 51.38,31.18 51.43,31.24 SWI15.RCL 50.16,34.44 SWI15.RCR
  Bottom 0.152: D15.ANOST D15.ANOT
N$16  (2 unrouted)
  Top 0.152: SWI16.RAL 70.49,28.57 SWI16.RCL 70.49,26.49 70.43,26.43 70.43,25.33 70.49,25.28 70.49,23.79 SWI16.RLMID 66.68,18.16 D16.ANOST D16.ANOT
  Bottom 0.152: D16.ANOST D16.ANOT
N$17  (1 unrouted)
  Top 0.152: D17.ANOST 88.26,2.54 | 88.26,2.54 D17.ANOT | SWI17.RAL SWI17.RAR 88.22,15.45 SWI17.RCL 89.53,12.2 89.48,12.14 89.48,11.04 89.53,10.99 89.53,9.52 85.72,5.71 SWI17.RLMID 88.26,3.15 88.26,2.54
  Bottom 0.152: D17.ANOST D17.ANOT
N$18  (2 unrouted)
  Top 0.152: SWI18.RAR 107.28,13.06 SWI18.RCL 108.59,9.81 108.53,9.76 108.53,8.66 108.59,8.6 108.59,7.12 SWI18.RLMID | D18.ANOST D18.ANOT
  Bottom 0.152: D18.ANOST D18.ANOT 101.15,15.24 101.64,15.73 106.19,15.73 107.63,14.29 SWI18.RCR
N$19  (via drill 0.45)
  Top 0.152: J1.A5 9.55,71.83 9.55,71.37 9.68,71.23 10.8,71.23 | R10.2 15.88,75.4 16.55,74.72 16.55,73.37 14.42,71.23 10.8,71.23 | v8.89,67.94 10.8,69.85 10.8,71.23
  Bottom 0.152: J1.B5 7.69,71.48 6.96,70.76 6.96,69.87 v8.89,67.94
N$20  (via drill 0.45)
  other vias: 47.63,73.66
N$21  (via drill 0.45)
  other vias: 39.37,72.39
N$22  (via drill 0.45)
  other vias: 31.75,78.74
N$23  (via drill 0.45)
  other vias: 40.01,52.7
N$24  (via drill 0.45)
  other vias: 45.09,47.62
N$25
  Top 0.152: R2.2 27.26,74.28 27.1,74.11 24.7,74.11 U2.CTRL
N$26
  Top 0.152: U2.VIN 24.76,77.08 25.15,77.08 25.28,77.21 25.28,79 25.15,79.13 23.66,79.13 22.99,78.47 C1.1 20.12,76.37 T1.E | R2.1 26.84,76.01 26.1,76.01 25.6,76.51 U2.VIN | D25.C 23.57,75.11 23.57,75.94 23.71,76.07 23.75,76.07 U2.VIN
N$27
  Top 0.152: LED1.C R3.1
N$28
  Top 0.152: U3.1 34.97,78.49 34.97,79.28 35.1,79.42 37.29,79.42 37.97,78.74 R3.2
N$29
  Top 0.152: U3.5 R4.2
N$31
  Top 0.152: U4.8 66.91,76.96 66.49,76.96 66.37,76.85 R7.1 64.77,76.67 65.45,76 65.45,75.1 65.31,74.97 64.22,74.97 63.65,75.55 R8.2
N$32
  Top 0.152: U4.9 66.91,76.46 66.49,76.46 66.35,76.33 66.35,75.58 65.44,74.67 62.63,74.67 61.74,75.55 R9.2
RESET  (4 unrouted)
ROW1  (via drill 0.45)
  Top 0.152: D1.CATT D1.CATST | D2.CATST D2.CATT | D3.CATST D3.CATT | D4.CATST D4.CATT | D5.CATST D5.CATT | D6.CATST D6.CATT | v94.23,37.46 94.23,38.44 92.65,40.02 92.65,50.29 91.68,51.26 U1.2
  Bottom 0.152: D1.CATST D1.CATT 6.98,54.61 8.58,54.61 8.93,54.26 10.12,54.26 10.47,54.61 D2.CATT D2.CATST 28.81,54.61 29.67,55.47 31.98,55.47 35.56,59.05 D3.CATT 45.72,59.05 | D3.CATST 45.72,59.05 | 45.72,59.05 48.57,56.2 50.76,56.2 52.35,54.61 D4.CATT D4.CATST 66.65,54.61 70.65,50.61 70.65,50 D5.CATT D5.CATST 86.61,37.46 v94.23,37.46 D6.CATT D6.CATST
ROW2  (via drill 0.45)
  Top 0.152: D7.CATST D7.CATT | D8.CATST D8.CATT | D9.CATST D9.CATT | D10.CATST D10.CATT 65.24,39.2 65.24,39.63 70.12,44.51 70.12,45.8 67.74,48.19 67.74,50.57 68.62,51.45 77.49,51.45 v88.26,62.23 | D11.CATST D11.CATT | D12.CATST D12.CATT | U1.38 88.68,77.25 v88.26,76.84
  Bottom 0.152: D8.CATT 10.47,35.56 10.12,35.21 8.93,35.21 8.58,35.56 6.98,35.56 D7.CATT D7.CATST | D8.CATST D8.CATT | D8.CATT 28.81,35.56 30.05,34.31 36.85,34.31 D9.CATT D9.CATST 47.86,40.01 49.1,38.76 53.22,38.76 54.46,40.01 57.15,40.01 D10.CATT D10.CATST 66.65,35.56 70.65,31.56 70.65,30.95 D11.CATT D11.CATST 85.98,19.05 D12.CATT D12.CATST | v88.26,76.84 v88.26,62.23
ROW3  (via drill 0.45)
  Top 0.152: D13.CATST D13.CATT | D14.CATT D14.CATST | D15.CATST D15.CATT | D16.CATST D16.CATT | D17.CATST D17.CATT | D18.CATST D18.CATT | U1.37 87.66,78.29 87.66,77.2 87,76.54 v87,75.56 | v76.84,48.26 76.84,19.05 75.56,17.78 v75.56,17.75
  Bottom 0.152: D13.CATST D13.CATT 22.86,16.51 D14.CATT 26.67,16.51 | D14.CATST 26.67,16.51 | D18.CATST D18.CATT 93.34,3.17 92.56,3.17 91.96,3.78 87.84,3.78 87.23,3.17 85.34,3.17 D17.CATST D17.CATT 78.66,5.16 78.66,15.47 76.37,17.75 v75.56,17.75 68.16,17.75 67.64,17.24 67.64,16.84 67.31,16.51 D16.CATST D16.CATT 55.27,22.84 49.1,22.84 47.86,21.59 D15.CATST D15.CATT 35.12,21.59 32.07,18.54 28.7,18.54 26.67,16.51 | v87,75.56 84.78,73.35 84.78,53.07 81.97,50.26 81.97,49.15 81.1,48.27 v76.84,48.27 v76.84,48.26
ROW5T1  (via drill 0.45)
  Top 0.152: U1.35 86.36,78.49 v86.36,76.84 | v53.98,73 53.98,69.9 54.55,69.32 54.55,21.68 53.22,20.34 47.02,20.34 46.71,20.04 46.71,18 45.72,17.01 INT1.T1
  Bottom 0.152: v86.36,76.84 83.48,76.84 82.82,77.49 73.34,77.49 68.85,73 v53.98,73
ROW6T2  (via drill 0.45)
  Top 0.152: U1.34 85.68,76.77 v85.09,76.18 | v54.63,71.75 54.63,69.67 54.86,69.45 54.86,21.49 52.77,19.41 47.85,19.41 47.27,18.82 47.27,18 47.85,17.42 48.62,17.42 50.16,15.88 INT1.T2
  Bottom 0.152: v85.09,76.18 82.87,76.18 82.82,76.22 72.5,76.22 68.98,72.7 55.57,72.7 v54.63,71.75
RX0
  Top 0.152: U4.17 76.31,69.91 U1.17
TX0
  Top 0.152: U1.19 75.31,71.41 70.81,75.91 70.81,76.33 70.68,76.46 70.25,76.46 U4.18
V+  (via drill 0.45)  (1 unrouted)
  Top 0.152: 64.38,77.59 64.09,77.29 64.09,76.41 64.77,75.73 R7.2 | 64.38,77.59 U4.7 63.38,77.59 v62.87,78.1 | J1.B9 10.82,72.81 10.77,72.77 10.77,72.51 10.37,72.11 10.11,72.11 J1.A4 | J1.B4 7.01,72.69 7.01,72.53 7.65,71.88 J1.A9 | v16.51,72.39 16.67,72.39 17.23,72.95 17.81,72.95 18.54,73.68 19.1,74.24 | 19.1,74.24 17.47,75.88 T1.B 17.71,76.13 | 64.38,77.59 62.91,77.59 | 19.1,74.24 D25.A 20.63,74.29 23.69,71.24 36.78,71.24 36.85,71.31 U3.4 42.98,75.88 LED1.A v48.26,78.74
  Top 0.381: 17.71,76.13 17.71,75.74 D25.A 18.54,73.68 R1.2
  Bottom 0.152: J1.B9 11.31,72.39 13.36,72.39 14.12,73.14 14.76,73.14 15.52,72.39 v16.51,72.39 | v62.87,78.1 48.9,78.1 v48.26,78.74
  pour Top (isolate 1.27, rank 3): 40.01,76.84 35.56,76.84 35.56,71.75 40.01,71.75
VCC  (via drill 0.45)
  Top 0.152: 34.27,75.56 34.27,74.95 34.29,74.93 33.93,74.56 C3.1 27.51,79.44 21.42,79.44 20.55,78.57 T1.C | 34.27,75.56 U3.3 | R5.2 72.38,76.84 v71.75,76.84 | v34.93,74.93 34.29,75.56 34.27,75.56
  Top 0.381: v55.24,20.95 55.88,21.59 v55.88,73.66
  Bottom 0.152: v71.75,76.84 68.58,73.66 v55.88,73.66 52.35,73.66 50.76,75.25 44.49,75.25 42.9,73.66 36.2,73.66 v34.93,74.93
  Bottom 0.381: JP1.1 53.34,19.05 v55.24,20.95
  pour Top (rank 2): 35.56,76.84 33.66,76.84 29.85,76.84 29.85,71.75 35.56,71.75

### Text on the board
tPlace: +
bPlace: +